# Altium schematic sheet CAN.SchDoc
size A4
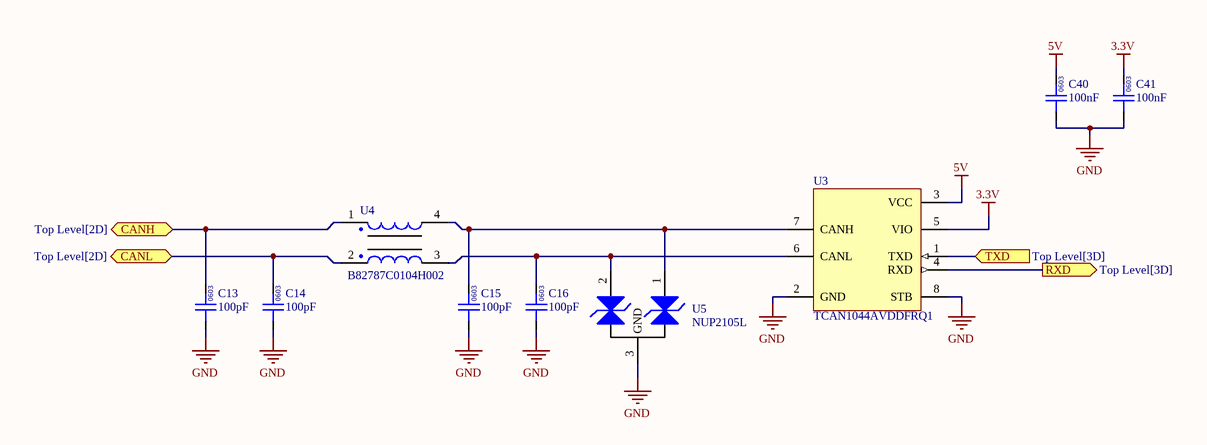
[diagram p0: CAN.SchDoc]

## Parts
C13  100pF  [0603]
C14  100pF  [0603]
C15  100pF  [0603]
C16  100pF  [0603]
C40  100nF  [0603]
C41  100nF  [0603]
U3  TCAN1044AVDDFRQ1  [TI SOT23-8]
U4  B82787C0104H002  [TDK 4-PC Pad]
U5  NUP2105L  [ON SOT-23]

## Ports
CANH (bidir, see Top Level[2D]), CANL (bidir, see Top Level[2D]), RXD (out, see Top Level[3D]), TXD (in, see Top Level[3D])

## Nets
3.3V: C41.2 U3.5(VIO)
5V: C40.2 U3.3(VCC)
GND: C13.1 C14.1 C15.1 C16.1 C40.1 C41.1 U3.2(GND) U3.8(STB) U5.3(GND)
CANH: C13.2 U4.1 ; port CANH
CANL: C14.2 U4.2 ; port CANL
RXD: U3.4(RXD) ; port RXD
TXD: U3.1(TXD) ; port TXD
NetC15_2: C15.2 U3.7(CANH) U4.4 U5.1(CAN_H)
NetC16_2: C16.2 U3.6(CANL) U4.3 U5.2(CAN_L)

## Notes on the sheet
- (in symbol GCM188L81H104KA57D) 0603
- (in symbol GRM1885C1H101JA01D) 0603

## Library data of the parts
C13-C16 = GRM1885C1H101JA01D: Manufacturer: Murata Electronics; Rated Voltage: 50V; Tolerance: ±5%; Material: MLCC; Temperature Rating: C0G, NP0; Part Number: GRM1885C1H101JA01D; Value: 100pF; Digikey Part Number: 490-1427-1-ND
C40 C41 = GCM188L81H104KA57D: Manufacturer: muRata; Rated Voltage: 50V; Tolerance: ±10%; Material: MLCC; Temperature Rating: X8L; Part Number: GCM188L81H104KA57D; Value: 100nF; Digikey Part Number: 490-6049-1-ND
U3 = TCAN1044AVDDFRQ1: IC TRANSCEIVER HALF 1/1 TSOT23-8; Manufacturer: Texas Instruments; Complex IC: 0; Part Number: TCAN1044AVDDFRQ1; Digikey Part Number: 296-TCAN1044AVDDFRQ1CT-ND
U4 = B82787C0104H002: Manufacturer: EPCOS (TDK); Value: 100µH @ 100kHz; Impedance: 5.8 kOhms @ 10MHz; Rated Current: 150mA; Part Number: B82787C0104H002; Material: Wirewound; Digikey Part Number: 495-4598-1-ND
U5 = NUP2105L: Dual Line CAN Bus Protector; Manufacturer: ON Semiconductor; Part Number: NUP2105L; Digikey Part Number: NUP2105LT1GOSCT-ND; Digikey Link: https://www.digikey.com/product-detail/en/on-semiconductor/NUP2105LT1G/NUP2105LT1GOSCT-ND/1485001